# Altium schematic sheet TxFM.SchDoc
size A4
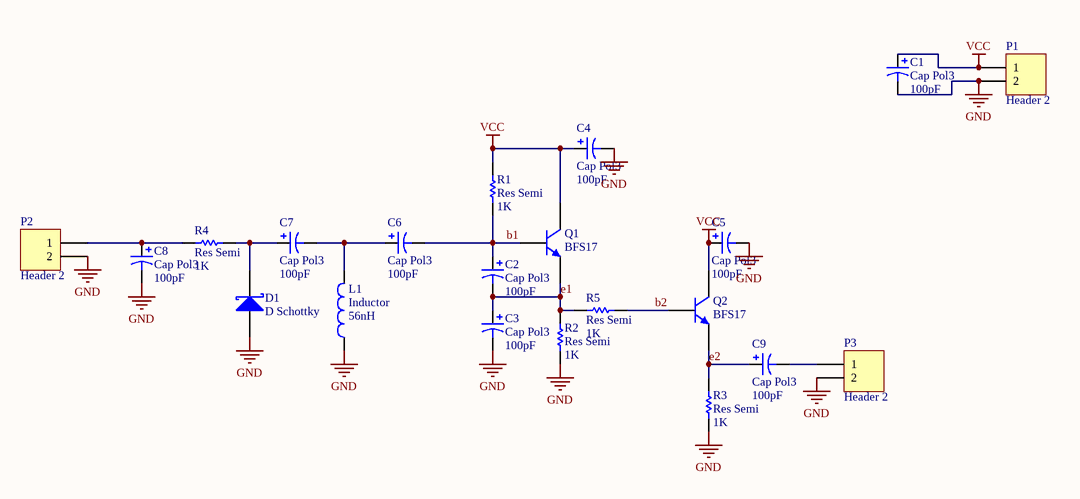
[diagram p0: TxFM.SchDoc]

## Parts
C1  Cap Pol3  value 100pF  [C0805]
C2  Cap Pol3  value 100pF  [C0805]
C3  Cap Pol3  value 100pF  [C0805]
C4  Cap Pol3  value 100pF  [C0805]
C5  Cap Pol3  value 100pF  [C0805]
C6  Cap Pol3  value 100pF  [C0805]
C7  Cap Pol3  value 100pF  [C0805]
C8  Cap Pol3  value 100pF  [C0805]
C9  Cap Pol3  value 100pF  [C0805]
D1  D Schottky  [SMB]
L1  Inductor  value 56nH  [0402-A]
P1  Header 2  [HDR1X2]
P2  Header 2  [HDR1X2]
P3  Header 2  [HDR1X2]
Q1  BFS17  [SOT23]
Q2  BFS17  [SOT23]
R1  Res Semi  value 1K  [2012[0805]]
R2  Res Semi  value 1K  [2012[0805]]
R3  Res Semi  value 1K  [2012[0805]]
R4  Res Semi  value 1K  [2012[0805]]
R5  Res Semi  value 1K  [2012[0805]]

## Nets
GND: C1.2 C3.2 C4.2 C5.2 C8.2 D1.1(A) L1.1 P1.2 P2.2 P3.2 R2.1 R3.1
VCC: C1.1 C4.1 C5.1 P1.1 Q1.3(C) Q2.3(C) R1.2
b1: C2.1 C6.2 Q1.1(B) R1.1
b2: Q2.1(B) R5.1
e1: C2.2 C3.1 Q1.2(E) R2.2 R5.2
e2: C9.1 Q2.2(E) R3.2
NetC6_1: C6.1 C7.2 L1.2
NetC7_1: C7.1 D1.2(K) R4.1
NetC8_1: C8.1 P2.1 R4.2
NetC9_2: C9.2 P3.1

## Library data of the parts
C1-C9 = Cap Pol3: Polarized Capacitor (Surface Mount); Published: 8-Jun-2000; LatestRevisionDate: 17-Jul-2002; LatestRevisionNote: Re-released for DXP Platform.; PackageReference: C0805; Publisher: Altium Limited
D1 = D Schottky: Schottky Diode; Published: 8-Jun-2000; LatestRevisionDate: 17-Jul-2002; LatestRevisionNote: Re-released for DXP Platform.; PackageReference: SMB; Publisher: Altium Limited; Code_JEDEC: DO-214-AA
L1 = Inductor: Code_IEC: 1005; Published: 8-Jun-2000; LatestRevisionDate: 17-Jul-2002; LatestRevisionNote: Re-released for DXP Platform.; PackageReference: 0402-A; Publisher: Altium Limited; Code_JEITA: 0402
P1-P3 = Header 2: Header, 2-Pin; LatestRevisionDate: 17-Jul-2002; LatestRevisionNote: Re-released for DXP Platform.; Publisher: Altium Limited
Q1 Q2 = BFS17: NPN 1 GHz Wideband Transistor; Published: 17-Sep-2003; DatasheetDocument: Sep-1995; PackageDocument: May-1999; PackageReference: SOT23; Publisher: Altium Limited; ComponentLink1Description: Manufacturer Link; ComponentLink1URL: http://www.semiconductors.philips.com/; ComponentLink2Description: Datasheet; ComponentLink2URL: http://www.semiconductors.philips.com/acrobat/datasheets/BFS17_2.pdf
R1-R5 = Res Semi: Semiconductor Resistor; Published: 8-Jun-2000; LatestRevisionDate: 17-Jul-2002; LatestRevisionNote: Re-released for DXP Platform.; PackageReference: AXIAL-0.5; Publisher: Altium Limited